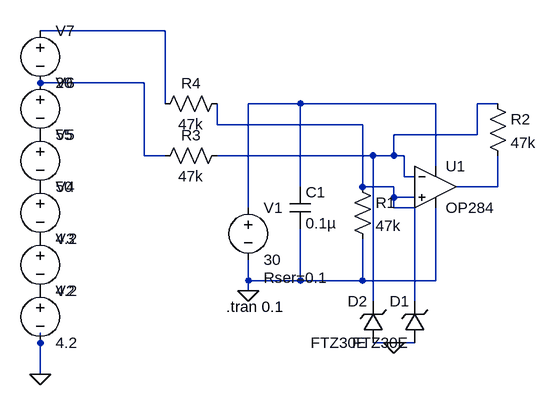
[diagram p0: schematic Draft1.asc]
Draft1.asc, the LTspice schematic file:
Version 4
SHEET 1 880 680
WIRE -16 -128 -208 -128
WIRE -48 -48 -208 -48
WIRE -16 -16 -16 -128
WIRE 192 -16 112 -16
WIRE 400 -16 192 -16
WIRE 496 -16 464 -16
WIRE 64 16 64 -16
WIRE 288 16 64 16
WIRE 464 32 464 -16
WIRE 464 32 336 32
WIRE -48 64 -48 -48
WIRE -16 64 -48 64
WIRE 304 64 64 64
WIRE 336 64 336 32
WIRE 336 64 304 64
WIRE 352 64 336 64
WIRE 400 80 400 -16
WIRE 352 96 352 64
WIRE 368 96 352 96
WIRE 192 112 192 -16
WIRE 288 112 288 16
WIRE 336 112 288 112
WIRE 496 112 496 64
WIRE 496 112 432 112
WIRE 336 128 336 112
WIRE 368 128 336 128
WIRE 112 144 112 -16
WIRE 336 144 336 128
WIRE 368 144 336 144
WIRE 112 256 112 224
WIRE 192 256 192 176
WIRE 192 256 112 256
WIRE 288 256 288 192
WIRE 288 256 192 256
WIRE 400 256 400 144
WIRE 400 256 288 256
WIRE 112 272 112 256
WIRE 304 288 304 64
WIRE 368 288 368 144
WIRE -208 352 -208 336
WIRE 336 352 304 352
WIRE 368 352 336 352
WIRE -208 400 -208 352
FLAG 112 272 0
FLAG -208 400 0
FLAG 336 352 0
SYMBOL voltage 112 128 R0
WINDOW 123 0 0 Left 0
WINDOW 39 24 124 Left 2
SYMATTR InstName V1
SYMATTR Value 30
SYMATTR SpiceLine Rser=0.1
SYMBOL cap 176 112 R0
SYMATTR InstName C1
SYMATTR Value 0.1µ
SYMATTR SpiceLine Rser=0.1m Lser=1n
SYMBOL voltage -208 256 R0
WINDOW 123 0 0 Left 0
WINDOW 39 0 0 Left 0
SYMATTR InstName V2
SYMATTR Value 4.2
SYMBOL voltage -208 176 R0
WINDOW 123 0 0 Left 0
WINDOW 39 0 0 Left 0
SYMATTR InstName V3
SYMATTR Value 4.2
SYMBOL voltage -208 96 R0
WINDOW 123 0 0 Left 0
WINDOW 39 0 0 Left 0
SYMATTR InstName V4
SYMATTR Value 4.2
SYMBOL voltage -208 16 R0
WINDOW 123 0 0 Left 0
WINDOW 39 0 0 Left 0
SYMATTR InstName V5
SYMATTR Value 50
SYMBOL voltage -208 -64 R0
WINDOW 123 0 0 Left 0
WINDOW 39 0 0 Left 0
SYMATTR InstName V6
SYMATTR Value 55
SYMBOL voltage -208 -144 R0
WINDOW 123 0 0 Left 0
WINDOW 39 0 0 Left 0
SYMATTR InstName V7
SYMATTR Value 20
SYMBOL res 272 96 R0
SYMATTR InstName R1
SYMATTR Value 47k
SYMATTR SpiceLine tol=1
SYMBOL res 480 -32 R0
SYMATTR InstName R2
SYMATTR Value 47k
SYMATTR SpiceLine tol=1
SYMBOL res 80 48 R90
WINDOW 0 0 56 VBottom 2
WINDOW 3 32 56 VTop 2
SYMATTR InstName R3
SYMATTR Value 47k
SYMATTR SpiceLine tol=1
SYMBOL res 80 -32 R90
WINDOW 0 0 56 VBottom 2
WINDOW 3 32 56 VTop 2
SYMATTR InstName R4
SYMATTR Value 47k
SYMATTR SpiceLine tol=1
SYMBOL zener 384 352 R180
WINDOW 0 24 64 Left 2
WINDOW 3 24 0 Left 2
SYMATTR InstName D1
SYMATTR Value FTZ30E
SYMBOL zener 320 352 R180
WINDOW 0 24 64 Left 2
WINDOW 3 24 0 Left 2
SYMATTR InstName D2
SYMATTR Value FTZ30E
SYMBOL OpAmps\\OP284 400 48 R0
SYMATTR InstName U1
TEXT 78 296 Left 2 !.tran 0.1

The netlist it stands for:
* Draft1.asc
V1 N003 0 30 Rser=0.1
C1 N003 0 0.1µ Rser=0.1m Lser=1n
V2 P001 0 4.2
V3 P002 P001 4.2
V4 P003 P002 4.2
V5 P004 P003 50
V6 N002 P004 55
V7 N001 N002 20
R1 N005 0 47k tol=1
R2 N004 N006 47k tol=1
R3 N004 N002 47k tol=1
R4 N005 N001 47k tol=1
D1 0 N005 FTZ30E
D2 0 N004 FTZ30E
XU1 N005 N004 N003 0 N006 OP284  ; pins In+ In- V+ V- OUT
.model D D
.lib standard.dio
.tran 0.1
.lib ADI1.lib
.backanno
.end